# Altium schematic sheet REGENIX_Relais_24V_4.SchDoc
size Tabloid; Date: Date; Author: Author 1; DocumentNumber: 2; Revision: 1; SheetNumber: 17; SheetTotal: 17; Size: 11x17; Sheet_Name: BATTERY PROTECTION & AUXILIARY
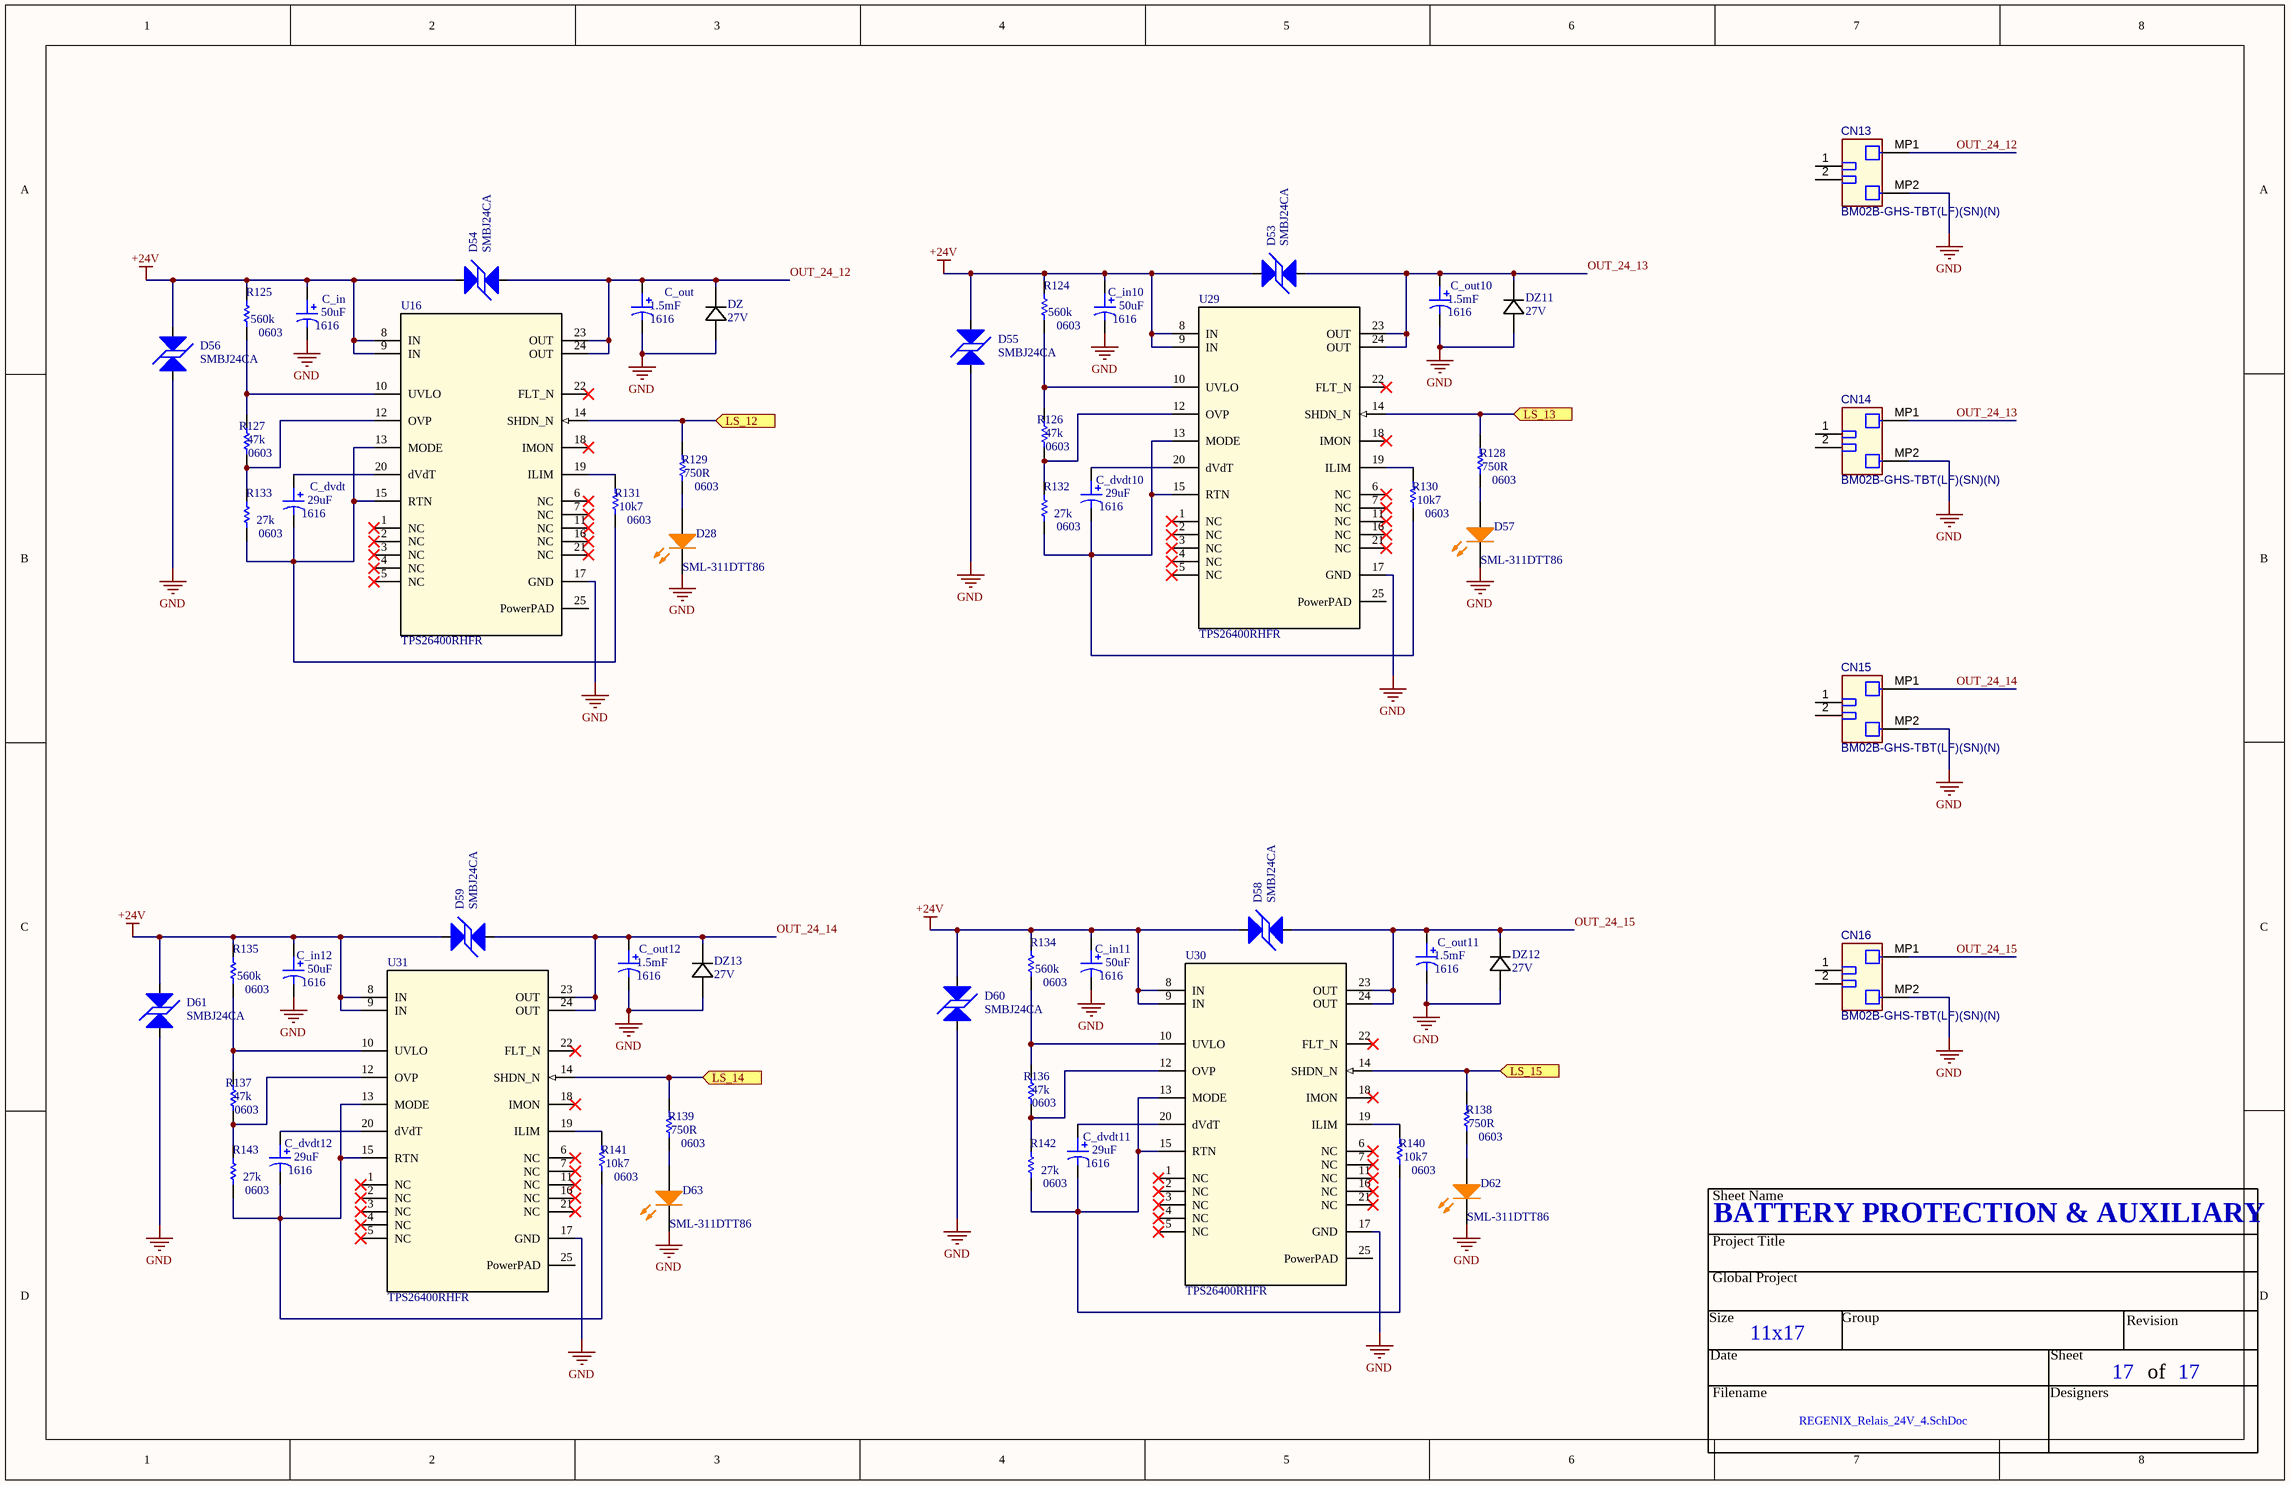
[diagram p0: REGENIX_Relais_24V_4.SchDoc]

## Parts
C_dvdt  value 29uF  Package: 1616  [CAP_ALU_1616_vishay]  (hidden comment: MAL214699108E3)
C_dvdt10  value 29uF  Package: 1616  [CAP_ALU_1616_vishay]  (hidden comment: MAL214699108E3)
C_dvdt11  value 29uF  Package: 1616  [CAP_ALU_1616_vishay]  (hidden comment: MAL214699108E3)
C_dvdt12  value 29uF  Package: 1616  [CAP_ALU_1616_vishay]  (hidden comment: MAL214699108E3)
C_in  value 50uF  Package: 1616  [CAP_ALU_1616_vishay]  (hidden comment: MAL214699108E3)
C_in10  value 50uF  Package: 1616  [CAP_ALU_1616_vishay]  (hidden comment: MAL214699108E3)
C_in11  value 50uF  Package: 1616  [CAP_ALU_1616_vishay]  (hidden comment: MAL214699108E3)
C_in12  value 50uF  Package: 1616  [CAP_ALU_1616_vishay]  (hidden comment: MAL214699108E3)
C_out  value 1.5mF  Package: 1616  [CAP_ALU_1616_vishay]  (hidden comment: MAL214699108E3)
C_out10  value 1.5mF  Package: 1616  [CAP_ALU_1616_vishay]  (hidden comment: MAL214699108E3)
C_out11  value 1.5mF  Package: 1616  [CAP_ALU_1616_vishay]  (hidden comment: MAL214699108E3)
C_out12  value 1.5mF  Package: 1616  [CAP_ALU_1616_vishay]  (hidden comment: MAL214699108E3)
CN13  BM02B-GHS-TBT(LF)(SN)(N)  [JST-BM02B-GHS-TBT_V]
CN14  BM02B-GHS-TBT(LF)(SN)(N)  [JST-BM02B-GHS-TBT_V]
CN15  BM02B-GHS-TBT(LF)(SN)(N)  [JST-BM02B-GHS-TBT_V]
CN16  BM02B-GHS-TBT(LF)(SN)(N)  [JST-BM02B-GHS-TBT_V]
D28  SML-311DTT86  [LED_0603]
D53  SMBJ24CA  [TVS_PWR_SMBJ36CA]
D54  SMBJ24CA  [TVS_PWR_SMBJ36CA]
D55  SMBJ24CA  [TVS_PWR_SMBJ36CA]
D56  SMBJ24CA  [TVS_PWR_SMBJ36CA]
D57  SML-311DTT86  [LED_0603]
D58  SMBJ24CA  [TVS_PWR_SMBJ36CA]
D59  SMBJ24CA  [TVS_PWR_SMBJ36CA]
D60  SMBJ24CA  [TVS_PWR_SMBJ36CA]
D61  SMBJ24CA  [TVS_PWR_SMBJ36CA]
D62  SML-311DTT86  [LED_0603]
D63  SML-311DTT86  [LED_0603]
DZ  27V  [SOD123_DIO]
DZ11  27V  [SOD123_DIO]
DZ12  27V  [SOD123_DIO]
DZ13  27V  [SOD123_DIO]
R124  Package: 0603  Precision: 560k  [RES_0603]  (hidden comment: RES - 0603)
R125  Package: 0603  Precision: 560k  [RES_0603]  (hidden comment: RES - 0603)
R126  Package: 0603  Precision: 47k  [RES_0603]  (hidden comment: RES - 0603)
R127  Package: 0603  Precision: 47k  [RES_0603]  (hidden comment: RES - 0603)
R128  Package: 0603  Precision: 750R  [RES_0603]  (hidden comment: RES - 0603)
R129  Package: 0603  Precision: 750R  [RES_0603]  (hidden comment: RES - 0603)
R130  Package: 0603  Precision: 10k7  [RES_0603]  (hidden comment: RES - 0603)
R131  Package: 0603  Precision: 10k7  [RES_0603]  (hidden comment: RES - 0603)
R132  Package: 0603  Precision: 27k  [RES_0603]  (hidden comment: RES - 0603)
R133  Package: 0603  Precision: 27k  [RES_0603]  (hidden comment: RES - 0603)
R134  Package: 0603  Precision: 560k  [RES_0603]  (hidden comment: RES - 0603)
R135  Package: 0603  Precision: 560k  [RES_0603]  (hidden comment: RES - 0603)
R136  Package: 0603  Precision: 47k  [RES_0603]  (hidden comment: RES - 0603)
R137  Package: 0603  Precision: 47k  [RES_0603]  (hidden comment: RES - 0603)
R138  Package: 0603  Precision: 750R  [RES_0603]  (hidden comment: RES - 0603)
R139  Package: 0603  Precision: 750R  [RES_0603]  (hidden comment: RES - 0603)
R140  Package: 0603  Precision: 10k7  [RES_0603]  (hidden comment: RES - 0603)
R141  Package: 0603  Precision: 10k7  [RES_0603]  (hidden comment: RES - 0603)
R142  Package: 0603  Precision: 27k  [RES_0603]  (hidden comment: RES - 0603)
R143  Package: 0603  Precision: 27k  [RES_0603]  (hidden comment: RES - 0603)
U16  TPS26400RHFR  [RHF0024A-IPC_A]
U29  TPS26400RHFR  [RHF0024A-IPC_A]
U30  TPS26400RHFR  [RHF0024A-IPC_A]
U31  TPS26400RHFR  [RHF0024A-IPC_A]

## Ports
LS_12 (in), LS_13 (in), LS_14 (in), LS_15 (in)

## Nets
+24V: C_in.1 C_in10.1 C_in11.1 C_in12.1 D53.1 D54.1 D55.1 D56.1 D58.1 D59.1 D60.1 D61.1 R124.2 R125.2 R134.2 R135.2 U16.8(IN) U16.9(IN) U29.8(IN) U29.9(IN) U30.8(IN) U30.9(IN) U31.8(IN) U31.9(IN)
GND: C_in.2 C_in10.2 C_in11.2 C_in12.2 C_out.2 C_out10.2 C_out11.2 C_out12.2 CN13.MP2 CN14.MP2 CN15.MP2 CN16.MP2 D28.K D55.2 D56.2 D57.K D60.2 D61.2 D62.K D63.K DZ.2 DZ11.2 DZ12.2 DZ13.2 U16.17(GND) U29.17(GND) U30.17(GND) U31.17(GND)
LS_12: R129.2 U16.14(SHDN_N) ; port LS_12
LS_13: R128.2 U29.14(SHDN_N) ; port LS_13
LS_14: R139.2 U31.14(SHDN_N) ; port LS_14
LS_15: R138.2 U30.14(SHDN_N) ; port LS_15
OUT_24_12: C_out.1 CN13.MP1 D54.2 DZ.1 U16.23(OUT) U16.24(OUT)
OUT_24_13: C_out10.1 CN14.MP1 D53.2 DZ11.1 U29.23(OUT) U29.24(OUT)
OUT_24_14: C_out12.1 CN15.MP1 D59.2 DZ13.1 U31.23(OUT) U31.24(OUT)
OUT_24_15: C_out11.1 CN16.MP1 D58.2 DZ12.1 U30.23(OUT) U30.24(OUT)
NetC_dvdt10_1: C_dvdt10.1 U29.20(dVdT)
NetC_dvdt10_2: C_dvdt10.2 R130.1 R132.1 U29.13(MODE) U29.15(RTN)
NetC_dvdt11_1: C_dvdt11.1 U30.20(dVdT)
NetC_dvdt11_2: C_dvdt11.2 R140.1 R142.1 U30.13(MODE) U30.15(RTN)
NetC_dvdt12_1: C_dvdt12.1 U31.20(dVdT)
NetC_dvdt12_2: C_dvdt12.2 R141.1 R143.1 U31.13(MODE) U31.15(RTN)
NetC_dvdt_1: C_dvdt.1 U16.20(dVdT)
NetC_dvdt_2: C_dvdt.2 R131.1 R133.1 U16.13(MODE) U16.15(RTN)
NetD28_A: D28.A R129.1
NetD57_A: D57.A R128.1
NetD62_A: D62.A R138.1
NetD63_A: D63.A R139.1
NetR124_1: R124.1 R126.2 U29.10(UVLO)
NetR125_1: R125.1 R127.2 U16.10(UVLO)
NetR126_1: R126.1 R132.2 U29.12(OVP)
NetR127_1: R127.1 R133.2 U16.12(OVP)
NetR130_2: R130.2 U29.19(ILIM)
NetR131_2: R131.2 U16.19(ILIM)
NetR134_1: R134.1 R136.2 U30.10(UVLO)
NetR135_1: R135.1 R137.2 U31.10(UVLO)
NetR136_1: R136.1 R142.2 U30.12(OVP)
NetR137_1: R137.1 R143.2 U31.12(OVP)
NetR140_2: R140.2 U30.19(ILIM)
NetR141_2: R141.2 U31.19(ILIM)

Not connected (* = marked no-connect by the designer): CN13 1 2; CN14 1 2; CN15 1 2; CN16 1 2; U16 1(NC)* 2(NC)* 3(NC)* 4(NC)* 5(NC)* 6(NC)* 7(NC)* 11(NC)* 16(NC)* 18(IMON)* 21(NC)* 22(FLT_N)* 25(PowerPAD); U29 1(NC)* 2(NC)* 3(NC)* 4(NC)* 5(NC)* 6(NC)* 7(NC)* 11(NC)* 16(NC)* 18(IMON)* 21(NC)* 22(FLT_N)* 25(PowerPAD); U30 1(NC)* 2(NC)* 3(NC)* 4(NC)* 5(NC)* 6(NC)* 7(NC)* 11(NC)* 16(NC)* 18(IMON)* 21(NC)* 22(FLT_N)* 25(PowerPAD); U31 1(NC)* 2(NC)* 3(NC)* 4(NC)* 5(NC)* 6(NC)* 7(NC)* 11(NC)* 16(NC)* 18(IMON)* 21(NC)* 22(FLT_N)* 25(PowerPAD)

## Notes on the sheet
- Sheet Name
- Project Title
- Global Project
- Revision
- Size
- Date
- Group
- Sheet
- of
- Filename
- Designers

## Library data of the parts
C_dvdt C_dvdt10-C_dvdt12 C_in C_in10-C_in12 C_out C_out10-C_out12 = CAP_ALU_MAL214699108E3: CAP - ALU 470uF 20% 50V - 1616; Current: 1.3A; Mfg: Vishay Dale; Mfg Part Number: MAL214699108E3; HelpURL: http://www.vishay.com/docs/28403/146cti.pdf; CreatedBy: Jonathan Bouchard; Temperature: -55°C to 125°C; Power: *; Supplier 1: Digikey; Supplier Part Number 1: 4442PHCT-ND
CN13-CN16 = CMP-002-00061-3: Disconnectable Crimp Style Connector, Pitch 1.25 mm, 1 x 2 Position, Height 4.05 mm, -25 to 85 degC, RoHS, Tape and Reel; Connector Type: Header,Shrouded; Mounting Technology: SurfaceMount; Case/Package: Disconnectable Crimp Style Connector, Pitch 1.25 mm, 1 x 2 Position, Height 4.05 mm; Pins: 4
D28 D57 D62 D63 = LED_SML-311DTT86: LED - 611nM ORANGE 2mA - 0603; Voltage: 1.8V; Mfg: ROHM Semiconductor; Power: 44mW; Current: 2mA; HelpURL: http://media.digikey.com/pdf/Data%20Sheets/Rohm%20PDFs/SML-311%20Series.pdf; CreatedBy: Jonathan Bouchard; Temperature: -40°C to 85°C; Package: 0603; Precision: *; Mfg Part Number: SML-311DTT86; Supplier 1: Digikey; Supplier Part Number 1: 511-1303-1-ND
D53-D56 D58-D61 = TVS_PWR_SMBJ24CA: TVS - 24V 26.7V 600W - DO214AA; Manufacturer #1: Littelfuse Inc.; Value: Vbr = 26.7V -  Clamp = 38.9V; Voltage Rating: 24V Standoff; Current Rating: 15.5A; GRAMS Lib Spec: 2.8; Magnetic Material: UNKNOWN; Polarized: NO; Tolerance: *; Power Max: 600W; HelpURL: http://www.littelfuse.com/~/media/electronics/datasheets/tvs_diodes/littelfuse_tvs_diode_smbj_datasheet.pdf.pdf; CreatedBy/Date: Arnaud Samson - 06/07/18; VerifiedBy: Jonathan Bouchard - 2018-07-13; Temperature: -65°C ~ 150°C (TJ); Package: DO214AA; Manufacturer #2: *; Note: *; Assembly Type: SMD; Part Number #2: *; Part Number #1: SMBJ24CA; Supplier 1: Digi-Key; Supplier Part Number 1: SMBJ24CALFCT-ND; Cryo: UNKNOWN
DZ DZ11-DZ13 = MMSZ5254B-7-F: DIODE ZENER 27V 500MW SOD123 MMSZ5254B-7-F; Mfr_Name: Diodes Inc
U16 U29-U31 = TPS26400RHFR: No Description Available; Mfr_Name: Texas Instruments; TYPE: TYPE; RefDes: RefDes
R124-R143 = RES - 0603: Current: *; CreatedBy: Jonathan Bouchard